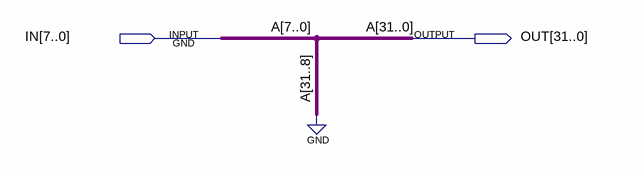
[diagram p0: schematic sheet]
// Quartus schematic zeroext8_32.bdf as structural Verilog: 0 symbols, 2 pins
module zeroext8_32 (
  input  [7:0] IN,
  output [31:0] OUT
);


  assign OUT = {{24{1'b0}}, IN};

  // Other names for the same wires on the sheet: A[7:0] = IN
endmodule
